# EAGLE design module-tpa3125 (EAGLE 7.7.0)
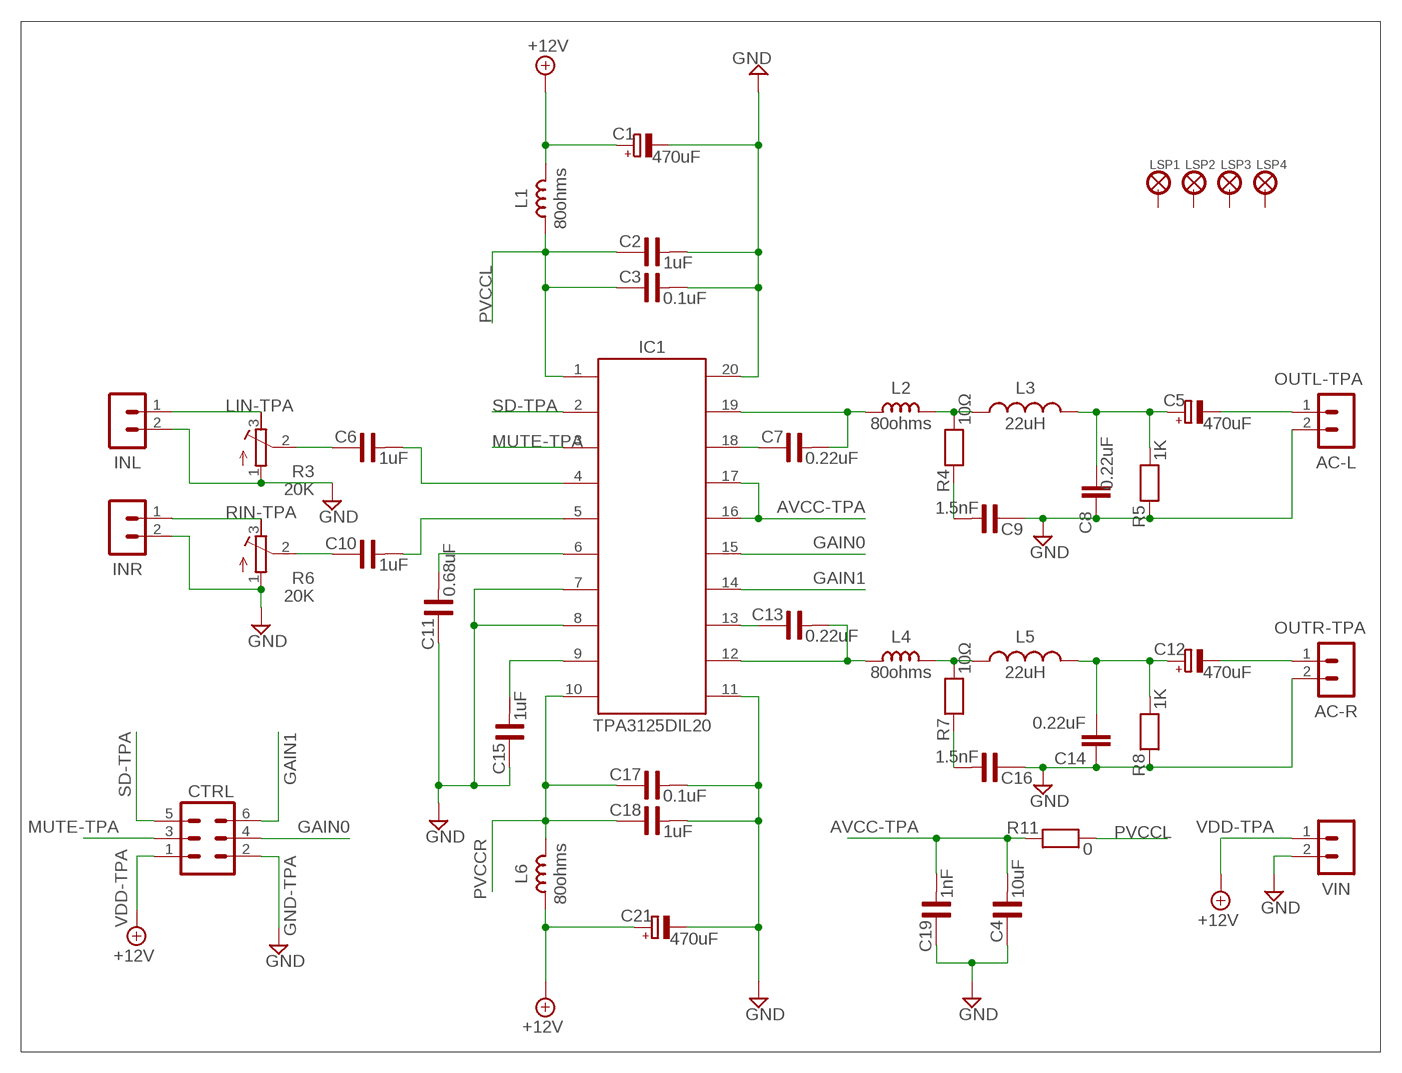
[diagram p0: schematic, sheet 1]

## Parts
AC-L  MA02-1GREEN  [MA02-1-GREEN]
AC-R  MA02-1GREEN  [MA02-1-GREEN]
C1  470uF  CPOL-EUE5-10.5  [E5-10,5]
C2  1uF  C-US1206  [C1206]
C3  0.1uF  C-US0805  [C0805]
C4  10uF  C-US0805  [C0805]
C5  470uF  CPOL-EUE5-10.5  [E5-10,5]
C6  1uF  C-US1206  [C1206]
C7  0.22uF  C-US0805  [C0805]
C8  0.22uF  C-EU050-050X075  [C050-050X075]
C9  1.5nF  C-US0805  [C0805]
C10  1uF  C-US1206  [C1206]
C11  0.68uF  C-US0805  [C0805]
C12  470uF  CPOL-EUE5-10.5  [E5-10,5]
C13  0.22uF  C-US0805  [C0805]
C14  0.22uF  C-EU050-050X075  [C050-050X075]
C15  1uF  C-US0805  [C0805]
C16  1.5nF  C-US0805  [C0805]
C17  0.1uF  C-US0805  [C0805]
C18  1uF  C-US1206  [C1206]
C19  1nF  C-US0805  [C0805]
C21  470uF  CPOL-EUE5-10.5  [E5-10,5]
CTRL  MA03-2  [MA03-2]
IC1  TPA3125DIL20  [DIL20]
INL  MA02-1GREEN  [MA02-1-GREEN]
INR  MA02-1GREEN  [MA02-1-GREEN]
L1  80ohms  L-USL0805  [L0805]
L2  80ohms  L-USL0805  [L0805]
L3  22uH  L-US6000-XXX-RC  [6000-XXXX-RC]
L4  80ohms  L-USL0805  [L0805]
L5  22uH  L-US6000-XXX-RC  [6000-XXXX-RC]
L6  80ohms  L-USL0805  [L0805]
LSP1  LSP27  [LSP27]
LSP2  LSP27  [LSP27]
LSP3  LSP27  [LSP27]
LSP4  LSP27  [LSP27]
R3  20K  PV32H  [PV32H]
R4  10Ω  R-US0805  [R0805]
R5  1K  R-US0805  [R0805]
R6  20K  PV32H  [PV32H]
R7  10Ω  R-US0805  [R0805]
R8  1K  R-US0805  [R0805]
R11  0  R-US0805  [R0805]
VIN  MA02-1GREEN  [MA02-1-GREEN]

## Nets
AVCC-TPA: C4.2 C19.2 IC1.16 IC1.17 R11.1
GAIN0: CTRL.4 IC1.15
GAIN1: CTRL.6 IC1.14
GND-TPA: AC-L.2 AC-R.2 C1.- C2.2 C3.2 C4.1 C8.1 C9.1 C11.1 C14.1 C15.1 C16.1 C17.2 C18.2 C19.1 C21.- CTRL.2 IC1.7 IC1.8 IC1.11 IC1.20 INL.2 INR.2 R3.1 R5.1 R6.1 R8.1 VIN.2 ; supply symbol labelled GND
LIN-TPA: INL.1 R3.3
MUTE-TPA: CTRL.3 IC1.3
N$2: C10.1 R6.2
N$3: C13.1 IC1.13
N$13: C6.1 R3.2
N$25: C6.2 IC1.4
N$26: C10.2 IC1.5
N$28: C11.2 IC1.6
N$29: C15.2 IC1.9
N$32: C7.1 IC1.18
N$33: C7.2 IC1.19 L2.1
N$34: C9.2 R4.1
N$35: L2.2 L3.1 R4.2
N$36: C5.+ C8.2 L3.2 R5.2
N$39: C16.2 R7.1
N$40: L4.2 L5.1 R7.2
N$41: C12.+ C14.2 L5.2 R8.2
N$42: C13.2 IC1.12 L4.1
OUTL-TPA: AC-L.1 C5.-
OUTR-TPA: AC-R.1 C12.-
PVCCL: C2.1 C3.1 IC1.1 L1.1 R11.2
PVCCR: C17.1 C18.1 IC1.10 L6.2
RIN-TPA: INR.1 R6.3
SD-TPA: CTRL.5 IC1.2
VDD-TPA: C1.+ C21.+ CTRL.1 L1.2 L6.1 VIN.1 ; supply symbol labelled +12V
Unconnected: LSP1.MP LSP2.MP LSP3.MP LSP4.MP

## Library data of the parts
AC-L AC-R INL INR VIN = MyComponents:MA02-1: Headers & Wire Housing, 1 Row, 3 Position
C1 C5 C12 C21 = rcl:CPOL-EU: POLARIZED CAPACITOR, European symbol
C2 C6 C10 C18 = MyComponents:C-US: SMD Multilayer Ceramic Capacitor
C3 C4 C7 C9 C11 C13 C15-C17 C19 = MyComponents:C-US: SMD Multilayer Ceramic Capacitor; MOUSER: 80-C0805C104J5RAUTO
C8 C14 = rcl:C-EU: CAPACITOR, European symbol
CTRL = MyComponents:MA03-2: Headers & Wire Housing, 2 Row, 6 Position; MOUSER: 68602-406HLF
IC1 = MyComponents:TPA3125: TPA3125D2: 10-W STEREO CLASS-D AUDIO POWER AMPLIFIER
L1 L2 L4 L6 = MyComponents:L-US: SMD Ferrite Bead; MOUSER: 963-CKP2012N1R0M-T
L3 L5 = rcl:L-US: INDUCTOR, American symbol
LSP1-LSP4 = MyComponents:LSP27: Solder Pad, drill 2.75 mm
R3 R6 = MyComponents:PV32H: BOURNS Trimmer Potentiometers Lead Sealed Type Single-turn PV32 Series
R4 R5 R7 R8 R11 = MyComponents:R-US: SMD Resistor; MOUSER: 660-RK73H2ATTDD1R00F

## Board
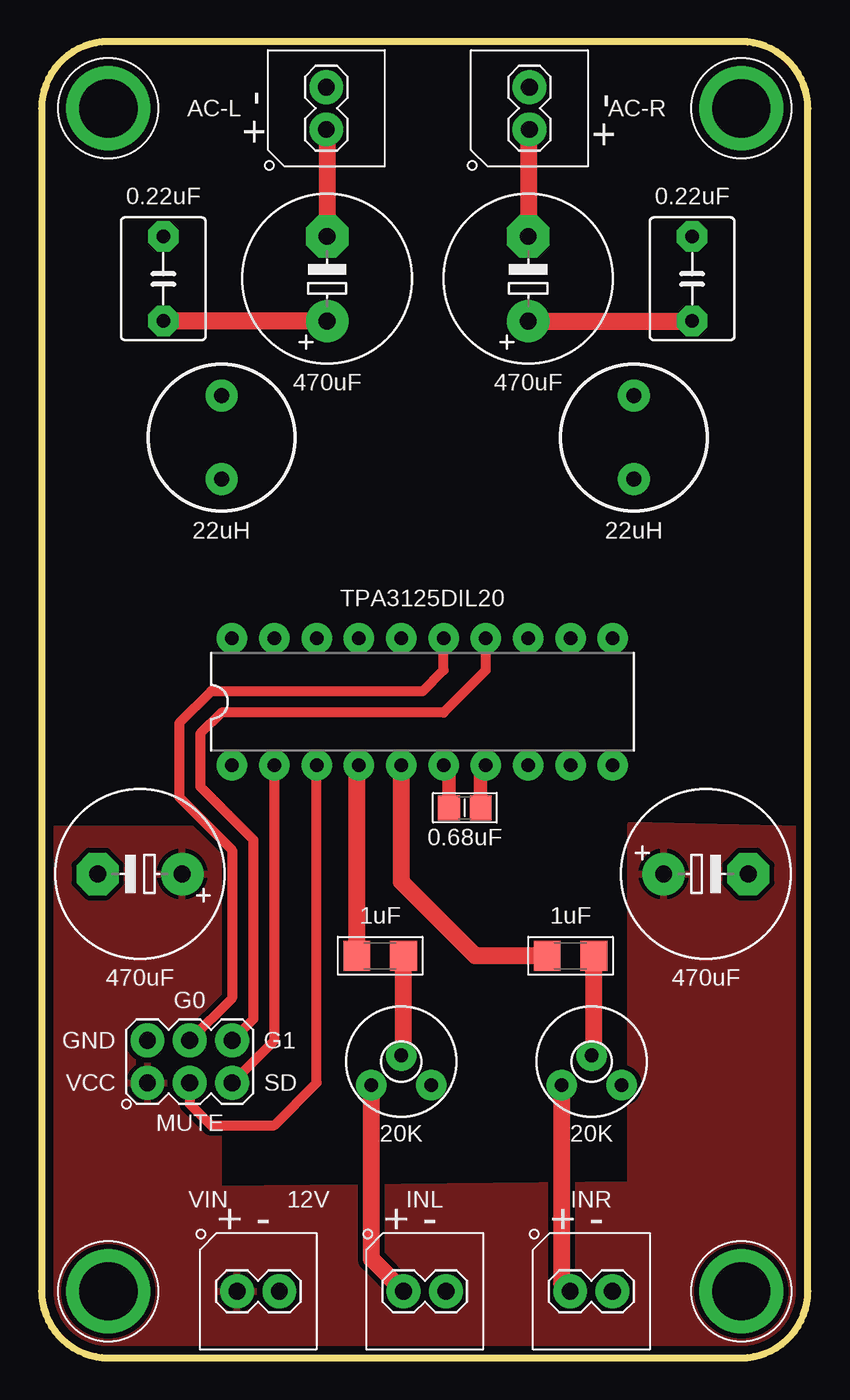
[diagram p1: board, top side]
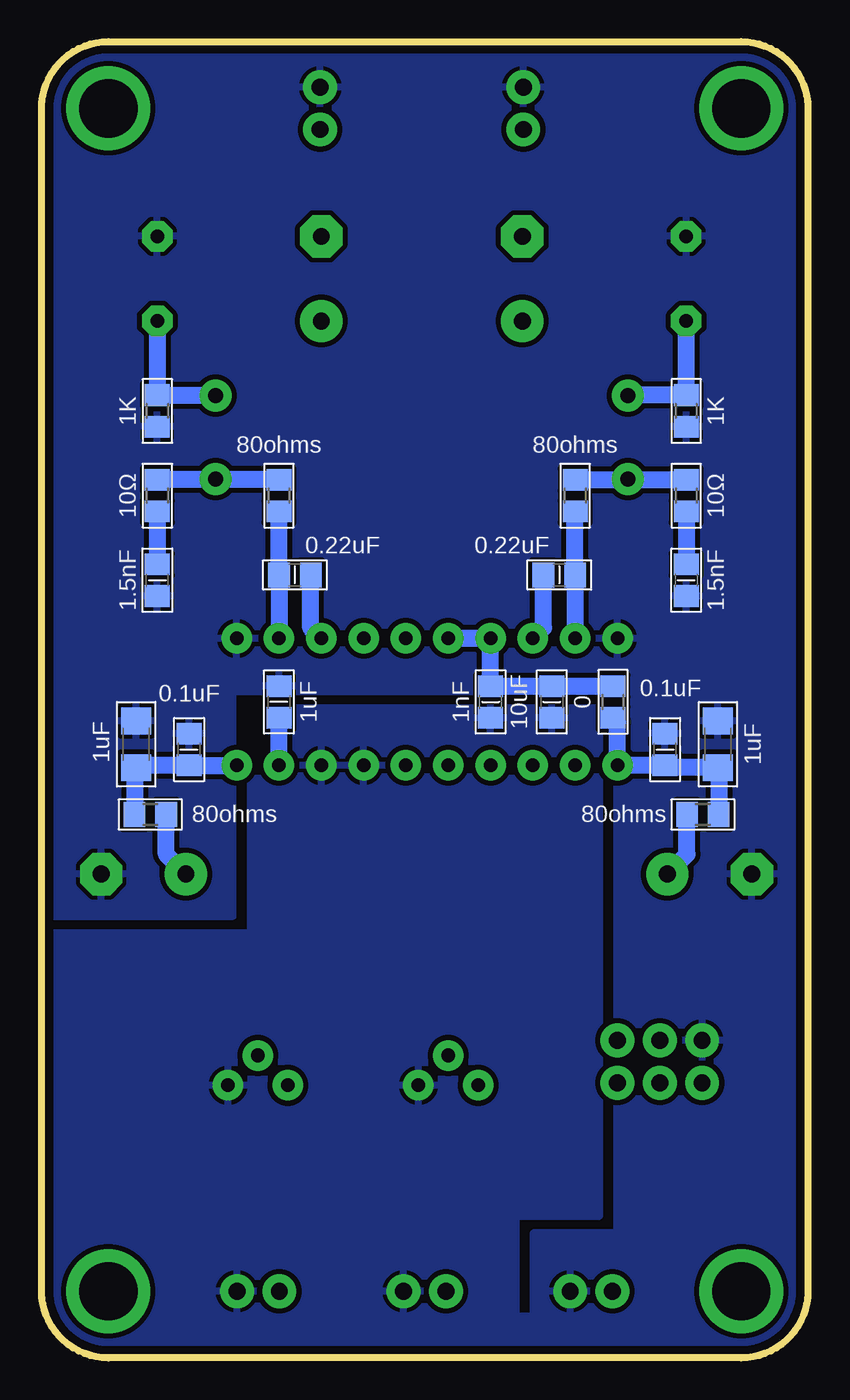
[diagram p2: board, bottom side, seen from below]

Size 46 x 79 mm. Coordinates in mm from the lower left corner, seen from the top.
Outline: 0,4 arc90 4,0 42,0 arc90 46,4 46,75 arc90 42,79 4,79 arc90 0,75 0,4
Copper layers (1*16): Top 0.035mm / dielectric 1.5mm / Bottom 0.035mm
Design rules "analog": minimum track width 15mil, minimum drill 19mil, track to track 12mil, track to pad 12mil, pad to pad 12mil, via to via 12mil, smd to smd 8mil, copper to edge 20mil, drill to drill 40mil, minimum pad ring 20mil, minimum via ring 12mil, stop-mask expansion 1mil, vias tented up to drill 0mil, thermal gap 10mil

### Footprints (pad centres in the part's own frame; a part is rotated, then mirrored left to right if it is on the bottom)
MA02-1-GREEN = drill 1.016: 1 -1.27,0; 2 1.27,0
E5-10,5 = drill 1.016 pad 2.54: + -2.54,0 | drill 1.016 pad 2.54 octagon: - 2.54,0
C1206 = smd 1.6 x 1.8: 1 -1.4,0; 2 1.4,0
C0805 = smd 1.3 x 1.5: 1 -0.95,0; 2 0.95,0
C050-050X075 = drill 0.813 octagon: 1 -2.54,0; 2 2.54,0
MA03-2 = drill 1.016: 1 -2.54,-1.27; 2 -2.54,1.27; 3 0,-1.27; 4 0,1.27; 5 2.54,-1.27; 6 2.54,1.27
DIL20 = drill 0.813: 1 -11.43,-3.81; 2 -8.89,-3.81; 3 -6.35,-3.81; 4 -3.81,-3.81; 5 -1.27,-3.81; 6 1.27,-3.81; 7 3.81,-3.81; 8 6.35,-3.81; 9 8.89,-3.81; 10 11.43,-3.81; 11 11.43,3.81; 12 8.89,3.81; 13 6.35,3.81; 14 3.81,3.81; 15 1.27,3.81; 16 -1.27,3.81; 17 -3.81,3.81; 18 -6.35,3.81; 19 -8.89,3.81; 20 -11.43,3.81
L0805 = smd 1.3 x 1.5: 1 -0.95,0; 2 0.95,0
6000-XXXX-RC = drill 0.9 pad 1.422: 1 -2.5,0; 2 2.5,0
LSP27 = drill 3.5 pad 5: MP 0,0
PV32H = drill 0.813: 1 1.798,-1.422; 2 0,0.374; 3 -1.794,-1.422
R0805 = smd 1.3 x 1.5: 1 -0.95,0; 2 0.95,0

### Placement (x,y rotation side)
AC-L  17.09,75 90 top
AC-R  29.28,75 90 top
C1  5.9,29.04 180 top
C2  5.4,36.83 90 bottom
C3  8.57,36.51 90 bottom
C4  15.38,39.37 90 bottom
C5  17.14,64.77 90 top
C6  20.32,24.13 180 top
C7  14.92,46.99 0 bottom
C8  7.3,64.77 270 top
C9  7.3,46.67 90 bottom
C10  31.75,24.13 180 top
C11  25.4,33.02 180 top
C12  29.21,64.77 90 top
C13  30.8,46.99 180 bottom
C14  39.05,64.77 270 top
C15  31.75,39.37 270 bottom
C16  39.05,46.67 90 bottom
C17  37.15,36.51 90 bottom
C18  40.32,36.83 90 bottom
C19  19.05,39.37 90 bottom
C21  39.88,29.04 0 top
CTRL  8.89,17.78 0 top
IC1  22.86,39.37 0 top
INL  23,4 0 top
INR  33,4 0 top
L1  6.3,32.62 180 bottom
L2  13.97,51.75 90 bottom
L3  10.79,55.24 90 top
L4  31.75,51.75 90 bottom
L5  35.56,55.24 90 top
L6  39.48,32.62 180 bottom
LSP1  4,75 0 top
LSP2  42,75 0 top
LSP3  42,4 0 top
LSP4  4,4 0 top
R3  21.59,17.78 0 top
R4  7.3,51.75 90 bottom
R5  7.3,56.83 90 bottom
R6  33.02,17.78 0 top
R7  39.05,51.75 90 bottom
R8  39.05,56.83 90 bottom
R11  11.7,39.37 270 bottom
VIN  13,4 0 top

### Tracks (layer width: path | path; a pad name or v marks a point on that pad's centre or on a via)
AVCC-TPA
  Bottom 1.016: IC1.16 IC1.17 C19.2 C4.2 R11.1
GAIN0
  Top 0.61: CTRL.4 11.43,21.59 11.43,30.48 8.26,33.66 8.26,38.1 10.16,40.01 22.86,40.01 24.13,41.27 IC1.15
GAIN1
  Top 0.61: CTRL.6 12.7,20.32 12.7,31.11 9.53,34.29 9.53,37.47 10.79,38.73 24.13,38.73 26.67,41.27 IC1.14
GND-TPA
  Top 0.813: C11.1 26.35,35.24 IC1.7
  pour Bottom: 0,0 0,79 46,79 46,26.5 34.5,26.5 34.5,40 11.5,40 11.5,7.5 16.5,7.5 16.5,0
  pour Bottom: 17.5,2.5 17.5,8.5 12.5,8.5 12.5,39 33.5,39 33.5,25.5 46,25.5 46,0 13,0 13,2.5
LIN-TPA
  Top 1.016: INL.1 19.8,5.93 R3.3
MUTE-TPA
  Top 0.61: CTRL.3 8.89,15.24 10.16,13.97 13.97,13.97 16.51,16.51 IC1.3
N$2
  Top 1.016: R6.2 33.15,18.28 C10.1
N$3
  Bottom 1.016: IC1.13 29.85,43.82 C13.1
N$13
  Top 0.813: R3.2 21.72,18.28
  Top 1.016: 21.72,18.28 C6.1
N$25
  Top 0.813: 18.92,35.43 IC1.4
  Top 1.016: C6.2 18.92,35.43
N$26
  Top 1.016: C10.2 26.04,24.13 21.59,28.57 IC1.5
N$28
  Top 0.813: C11.2 24.45,35.24 IC1.6
N$29
  Bottom 1.016: IC1.9 C15.2
N$32
  Bottom 1.016: IC1.18 15.87,43.82 C7.1
N$33
  Bottom 1.016: IC1.19 C7.2 arc-90 C7.2 L2.1 arc90 L2.1
N$34
  Bottom 1.016: R4.1 C9.2
N$35
  Bottom 0.813: L3.1 10.75,52.7
  Bottom 1.016: L2.2 10.84,52.7 arc-90 L3.1 | 10.75,52.7 R4.2
N$36
  Top 1.016: C5.+ C8.2
  Bottom 1.016: C8.2 R5.2 10.79,57.78 L3.2
N$39
  Bottom 1.016: R7.1 C16.2
N$40
  Bottom 0.813: R7.2 39.01,52.74
  Bottom 1.016: L4.2 35.52,52.7 arc90 L5.1 39.01,52.74
N$41
  Top 1.016: C12.+ C14.2
  Bottom 1.016: L5.2 35.56,57.78 R8.2 C14.2
N$42
  Bottom 1.016: L4.1 arc90 L4.1 C13.2 IC1.12
OUTL-TPA
  Top 1.016: AC-L.1 17.14,73.93 C5.-
OUTR-TPA
  Top 1.016: AC-R.1 29.21,73.87 C12.-
PVCCL
  Bottom 0.813: C3.1 8.44,35.43 | 11.43,38.15 R11.2 | C2.1 5.36,35.43
  Bottom 1.016: C3.1 IC1.1 11.43,38.15 | C2.1 8.44,35.43 | 5.36,35.43 L1.1
PVCCR
  Bottom 0.813: C17.1 | 40.19,35.56 C18.1 40.42,35.33
  Bottom 1.016: C17.1 IC1.10 | C17.1 40.19,35.56 | 40.42,35.33 L6.2
RIN-TPA
  Top 1.016: INR.1 31.23,4.5 R6.3
SD-TPA
  Top 0.61: CTRL.5 13.97,19.05 IC1.2
VDD-TPA
  Bottom 1.016: C1.+ 7.25,30.23 L1.2 | C21.+ 38.52,30.23 L6.1
  pour Top: 0,0 0,31.75 10.6,31.75 10.6,10.16 35.37,10.41 35.37,32 45.72,31.75 45.72,0

### Text on the board
tPlace: + - | + - | + - | + - | + -
tNames: G0 | GND | G1 | VCC | SD | MUTE | 12V